# EAGLE design moonlamp (EAGLE 6.4)
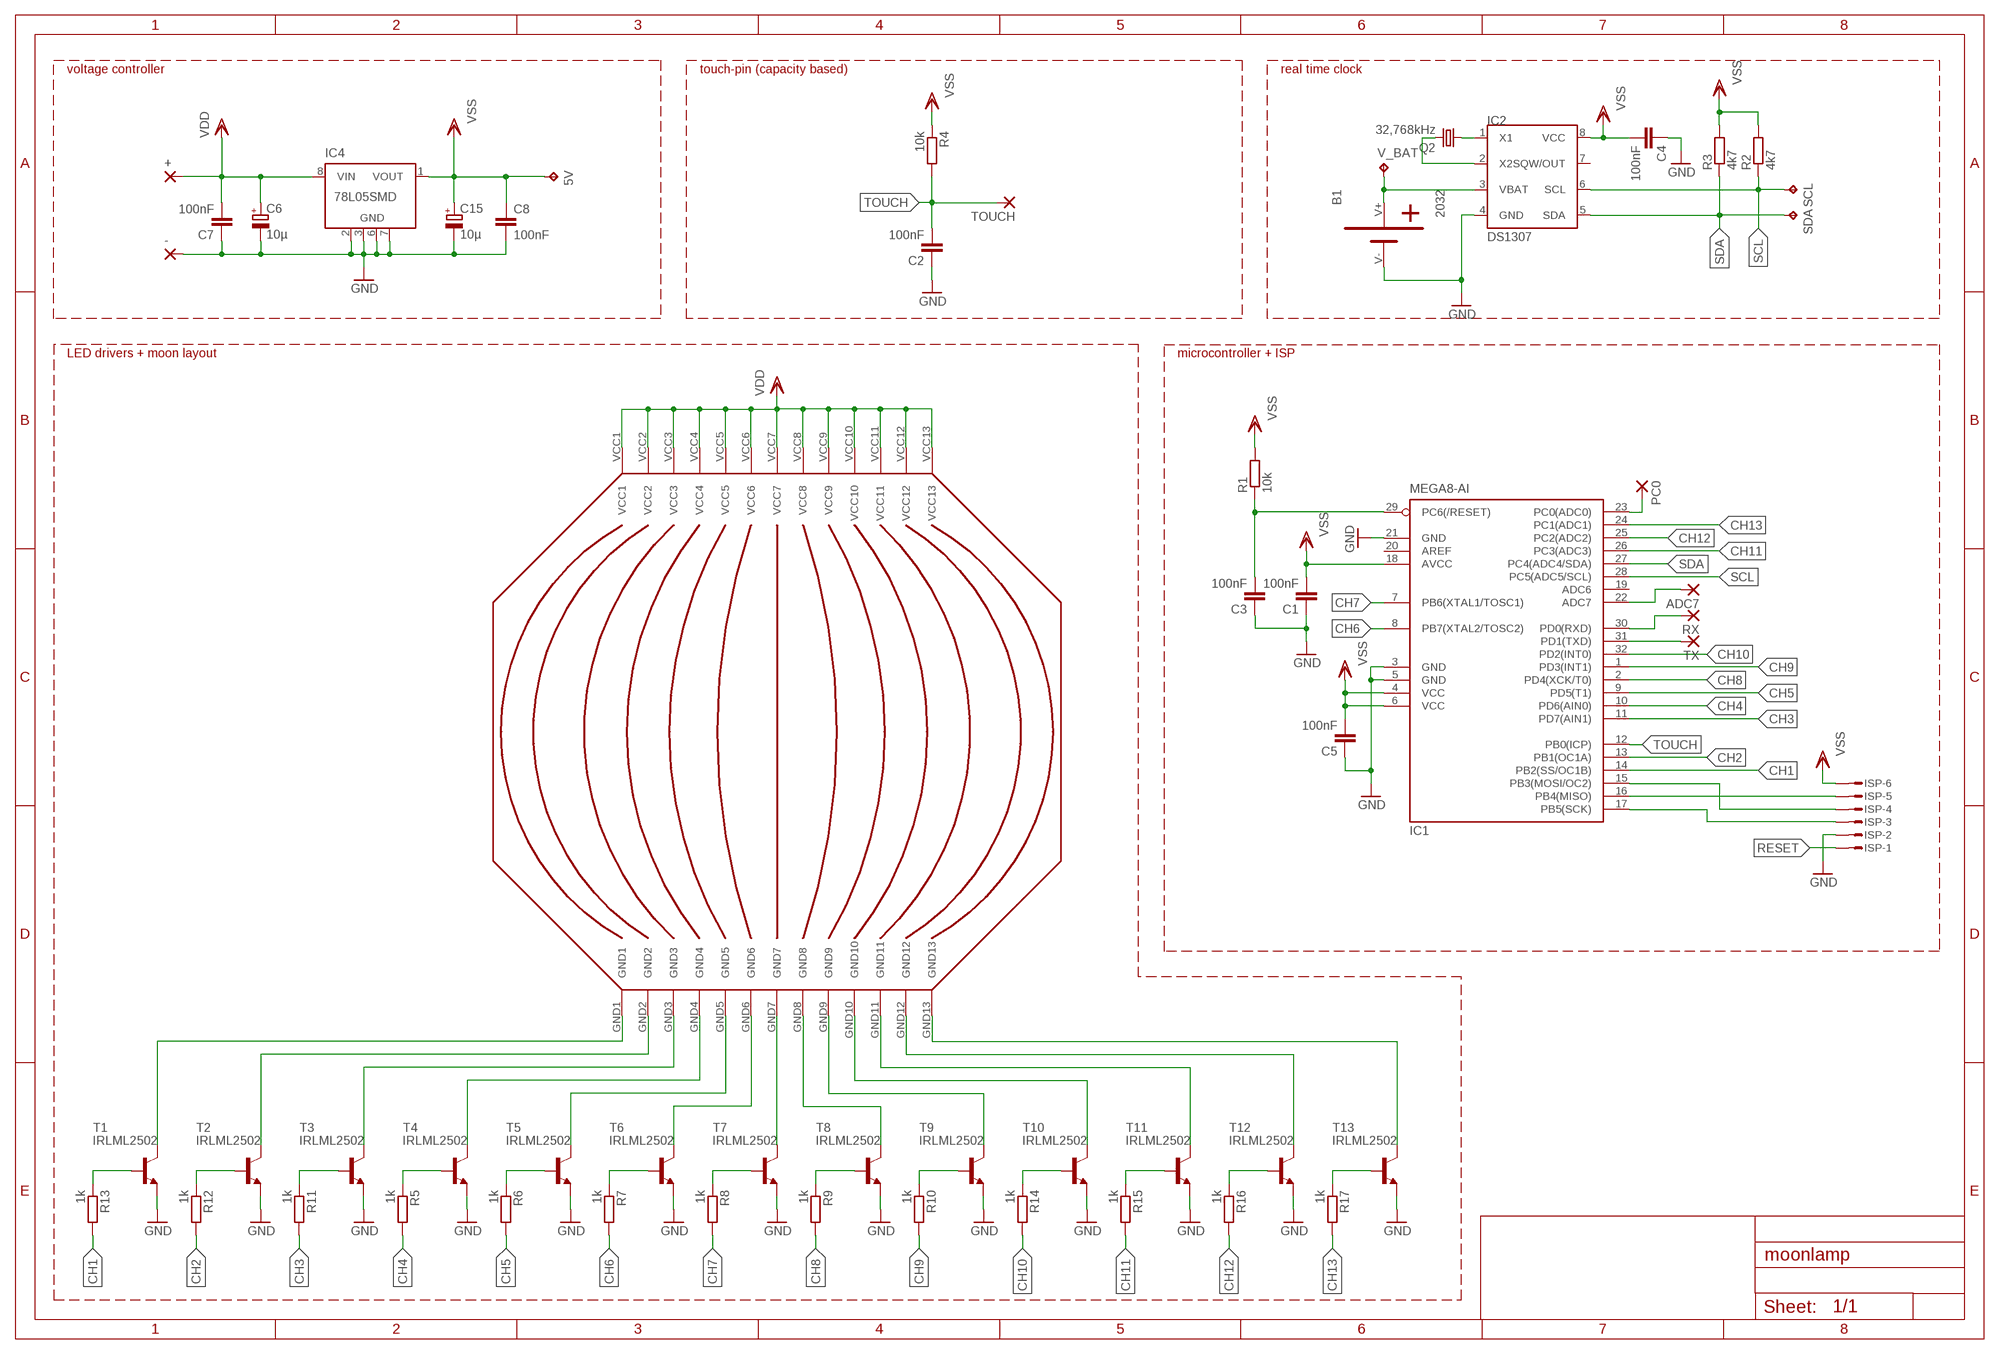
[diagram p0: schematic, sheet 1]

## Parts
5V  TPB1,27  [B1,27]
+  SMD5  [SMD2,54-5,08]
-  SMD5  [SMD2,54-5,08]
ADC7  SMD2  [SMD1,27-2,54]
B1  2032  [2032]
C1  100nF  C-EUC0603  [C0603]
C2  100nF  C-EUC0603  [C0603]
C3  100nF  C-EUC0603K  [C0603K]
C4  100nF  C-EUC0603  [C0603]
C5  100nF  C-EUC0603  [C0603]
C6  10µ  CPOL-EUSMCA  [SMC_A]
C7  100nF  C-EUC0603K  [C0603K]
C8  100nF  C-EUC0603K  [C0603K]
C15  10µ  CPOL-EUSMCA  [SMC_A]
IC1  MEGA8-AI  [TQFP32-08]
IC2  DS1307  [SOIC-8]
IC4  78L05SMD  [SO08]
ISP  MICROMATCH-6SMF  [MMT-F-SMD-6]
PC0  SMD2  [SMD1,27-2,54]
Q2  32,768kHz  CRYSTALMM20SS  [MM20SS]
R1  10k  R-EU_R0603  [R0603]
R2  4k7  R-EU_R0603  [R0603]
R3  4k7  R-EU_R0603  [R0603]
R4  10k  R-EU_R0603  [R0603]
R5  1k  R-EU_R1206  [R1206]
R6  1k  R-EU_R1206  [R1206]
R7  1k  R-EU_R1206  [R1206]
R8  1k  R-EU_R1206  [R1206]
R9  1k  R-EU_R1206  [R1206]
R10  1k  R-EU_R1206  [R1206]
R11  1k  R-EU_R1206  [R1206]
R12  1k  R-EU_R1206  [R1206]
R13  1k  R-EU_R1206  [R1206]
R14  1k  R-EU_R1206  [R1206]
R15  1k  R-EU_R1206  [R1206]
R16  1k  R-EU_R1206  [R1206]
R17  1k  R-EU_R1206  [R1206]
RX  SMD2  [SMD1,27-2,54]
SCL  TPB1,27  [B1,27]
SDA  TPB1,27  [B1,27]
T1  IRLML2502  BC847  [SOT23]
T2  IRLML2502  BC847  [SOT23]
T3  IRLML2502  BC847  [SOT23]
T4  IRLML2502  BC847  [SOT23]
T5  IRLML2502  BC847  [SOT23]
T6  IRLML2502  BC847  [SOT23]
T7  IRLML2502  BC847  [SOT23]
T8  IRLML2502  BC847  [SOT23]
T9  IRLML2502  BC847  [SOT23]
T10  IRLML2502  BC847  [SOT23]
T11  IRLML2502  BC847  [SOT23]
T12  IRLML2502  BC847  [SOT23]
T13  IRLML2502  BC847  [SOT23]
TOUCH  SMD2  [SMD1,27-2,54]
TX  SMD2  [SMD1,27-2,54]
U$1  MOON  [MOON]
V_BAT  TPB1,27  [B1,27]

## Nets
CH1: IC1.14(PB2(SS/OC1B)) R13.2
CH2: IC1.13(PB1(OC1A)) R12.2
CH3: IC1.11(PD7(AIN1)) R11.2
CH4: IC1.10(PD6(AIN0)) R5.2
CH5: IC1.9(PD5(T1)) R6.2
CH6: IC1.8(PB7(XTAL2/TOSC2)) R7.2
CH7: IC1.7(PB6(XTAL1/TOSC1)) R8.2
CH8: IC1.2(PD4(XCK/T0)) R9.2
CH9: IC1.1(PD3(INT1)) R10.2
CH10: IC1.32(PD2(INT0)) R14.2
CH11: IC1.26(PC3(ADC3)) R15.2
CH12: IC1.25(PC2(ADC2)) R16.2
CH13: IC1.24(PC1(ADC1)) R17.2
GND: -.1(P) B1.V- C1.1 C2.1 C3.1 C4.1 C5.1 C6.- C7.1 C8.2 C15.- IC1.3(GND) IC1.5(GND) IC1.21(GND) IC2.4(GND) IC4.2(GND) IC4.3(GND) IC4.6(GND) IC4.7(GND) ISP.2 T1.2(E) T2.2(E) T3.2(E) T4.2(E) T5.2(E) T6.2(E) T7.2(E) T8.2(E) T9.2(E) T10.2(E) T11.2(E) T12.2(E) T13.2(E)
N$2: ADC7.1(P) IC1.22(ADC7)
N$3: R5.1 T4.1(B)
N$4: IC1.31(PD1(TXD)) TX.1(P)
N$5: R6.1 T5.1(B)
N$6: R7.1 T6.1(B)
N$7: R8.1 T7.1(B)
N$8: R9.1 T8.1(B)
N$9: R10.1 T9.1(B)
N$10: B1.V+ IC2.3(VBAT) V_BAT.TP
N$11: R11.1 T3.1(B)
N$12: R12.1 T2.1(B)
N$13: IC2.1(X1) Q2.1
N$14: IC2.2(X2) Q2.4
N$16: R13.1 T1.1(B)
N$17: R14.1 T10.1(B)
N$18: R15.1 T11.1(B)
N$19: R16.1 T12.1(B)
N$20: R17.1 T13.1(B)
N$21: T7.3(C) U$1.GND7
N$22: IC1.30(PD0(RXD)) RX.1(P)
N$24: IC1.17(PB5(SCK)) ISP.3
N$25: IC1.16(PB4(MISO)) ISP.5
N$26: T1.3(C) U$1.GND1
N$27: T2.3(C) U$1.GND2
N$28: T3.3(C) U$1.GND3
N$29: T4.3(C) U$1.GND4
N$30: T5.3(C) U$1.GND5
N$31: T6.3(C) U$1.GND6
N$32: T8.3(C) U$1.GND8
N$33: T9.3(C) U$1.GND9
N$34: T10.3(C) U$1.GND10
N$35: T11.3(C) U$1.GND11
N$36: T12.3(C) U$1.GND12
N$37: T13.3(C) U$1.GND13
N$38: IC1.23(PC0(ADC0)) PC0.1(P)
N$40: IC1.15(PB3(MOSI/OC2)) ISP.4
RESET: C3.2 IC1.29(PC6(/RESET)) ISP.1 R1.1
SCL: IC1.28(PC5(ADC5/SCL)) IC2.6(SCL) R2.1 SCL.TP
SDA: IC1.27(PC4(ADC4/SDA)) IC2.5(SDA) R3.1 SDA.TP
TOUCH: C2.2 IC1.12(PB0(ICP)) R4.2 TOUCH.1(P)
VDD: +.1(P) C6.+ C7.2 IC4.8(VIN) U$1.VCC1 U$1.VCC2 U$1.VCC3 U$1.VCC4 U$1.VCC5 U$1.VCC6 U$1.VCC7 U$1.VCC8 U$1.VCC9 U$1.VCC10 U$1.VCC11 U$1.VCC12 U$1.VCC13
VSS: 5V.TP C1.2 C4.2 C5.2 C8.1 C15.+ IC1.4(VCC) IC1.6(VCC) IC1.18(AVCC) IC2.8(VCC) IC4.1(VOUT) ISP.6 R1.2 R2.2 R3.2 R4.1
Unconnected: IC1.19(ADC6) IC1.20(AREF) IC2.7(SQW/OUT) IC4.4(NC) IC4.5(NC)

## Notes on the sheet
- voltage controller | touch-pin (capacity based) | real time clock
- LED drivers + moon layout | microcontroller + ISP

## Library data of the parts
5V SCL SDA V_BAT = testpad:TP: Test pad
+ - = wirepad:SMD5: SMD PAD
ADC7 PC0 RX TOUCH TX = wirepad:SMD2: SMD PAD
B1 = 2032:2032: Reichelt: KZH 20SMD-2
C1-C5 C7 C8 = rcl:C-EU: CAPACITOR, European symbol
C6 C15 = rcl:CPOL-EU: POLARIZED CAPACITOR, European symbol
IC1 = atmel:MEGA8: MICROCONTROLLER 8 Kbytes FLASH, 1 kbytes SRAM, 512 bytes EEPROM, USART, 6-channel 10 bit ADC, 2-channel 8 bit ADC Pin compatible with Atmega48, ATMega88, ATMega168 Source: avr.lbr
IC2 = dallas-1:DS1307: I2C Serial RTC w/56 bytes battery backed RAM
IC4 = linear:78L*SMD: Positive VOLTAGE REGULATOR
ISP = con-amp-micromatch2:MICROMATCH-6: MicroMaTch 6 7-215464-6 / 0-215464-6 Drawing Number C-215464 DDEController.pdf
Q2 = crystal:CRYSTAL: CRYSTAL
R1-R17 = rcl:R-EU_: RESISTOR, European symbol
T1-T13 = transistor:BC847: NPN TRANSISTOR
U$1 = moon:MOON

## Board
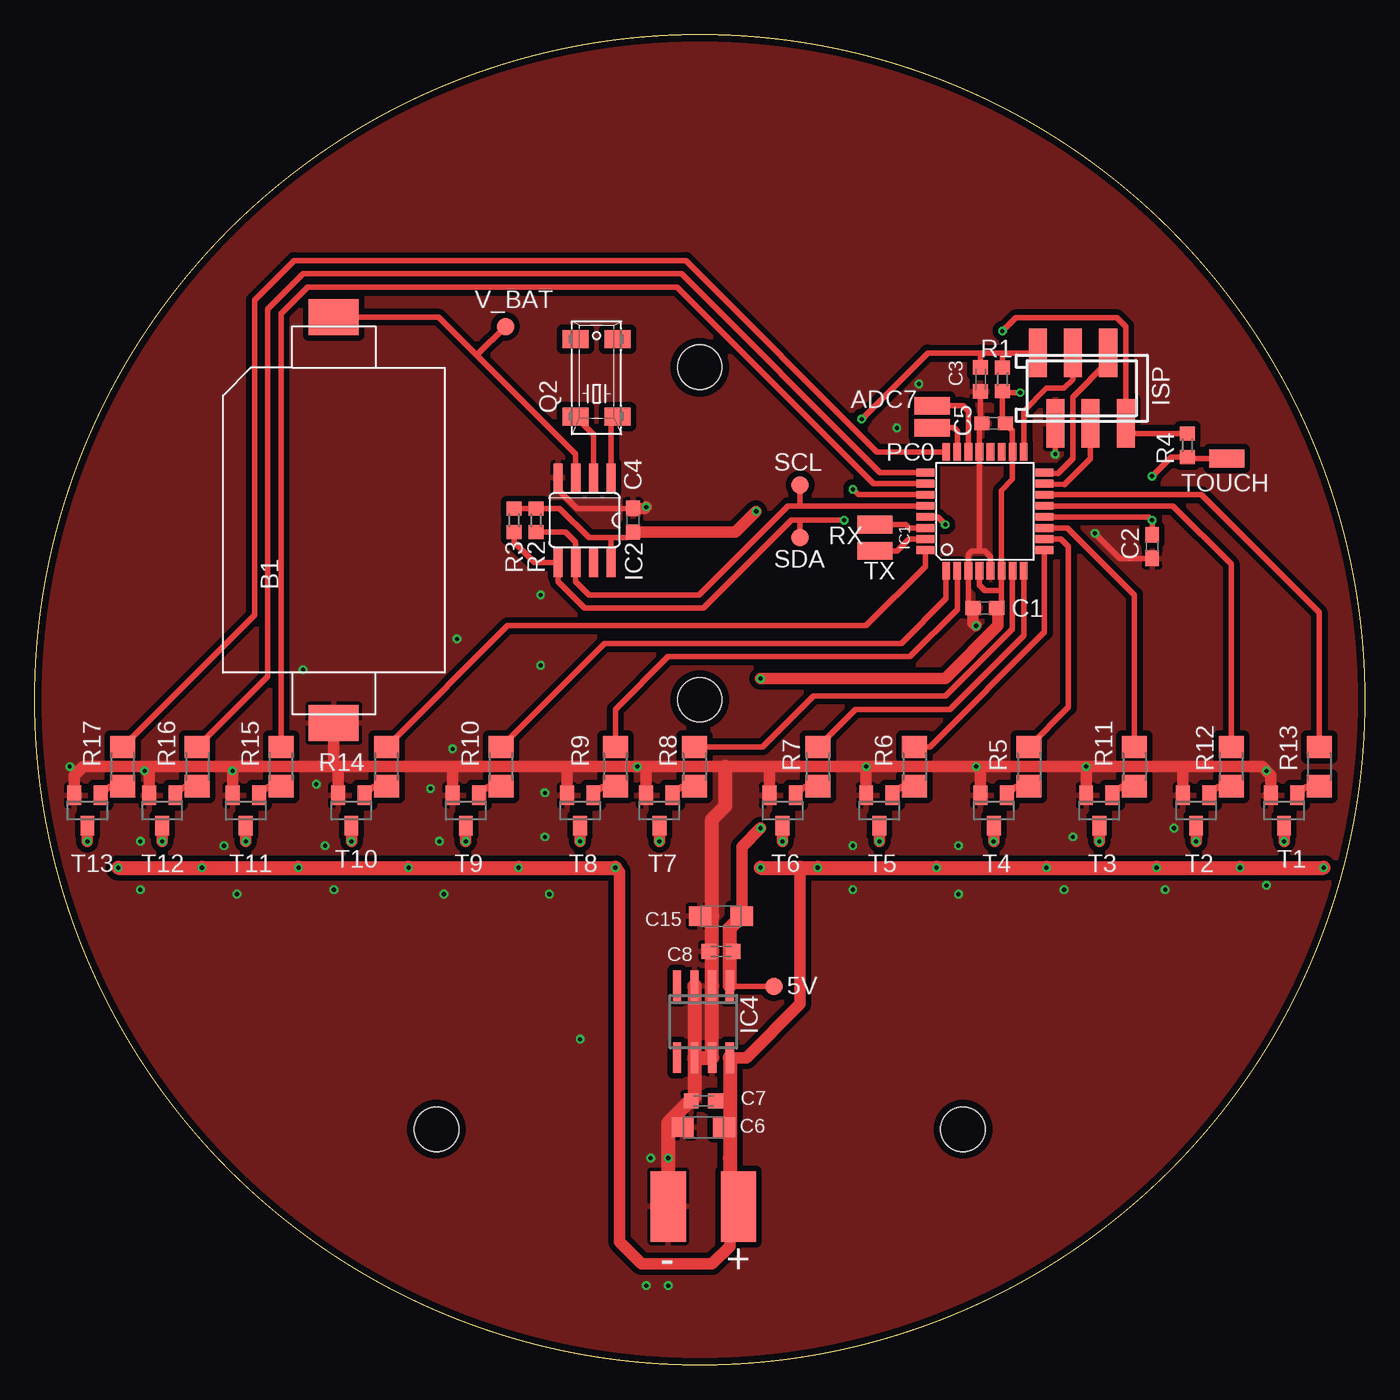
[diagram p1: board, top side]
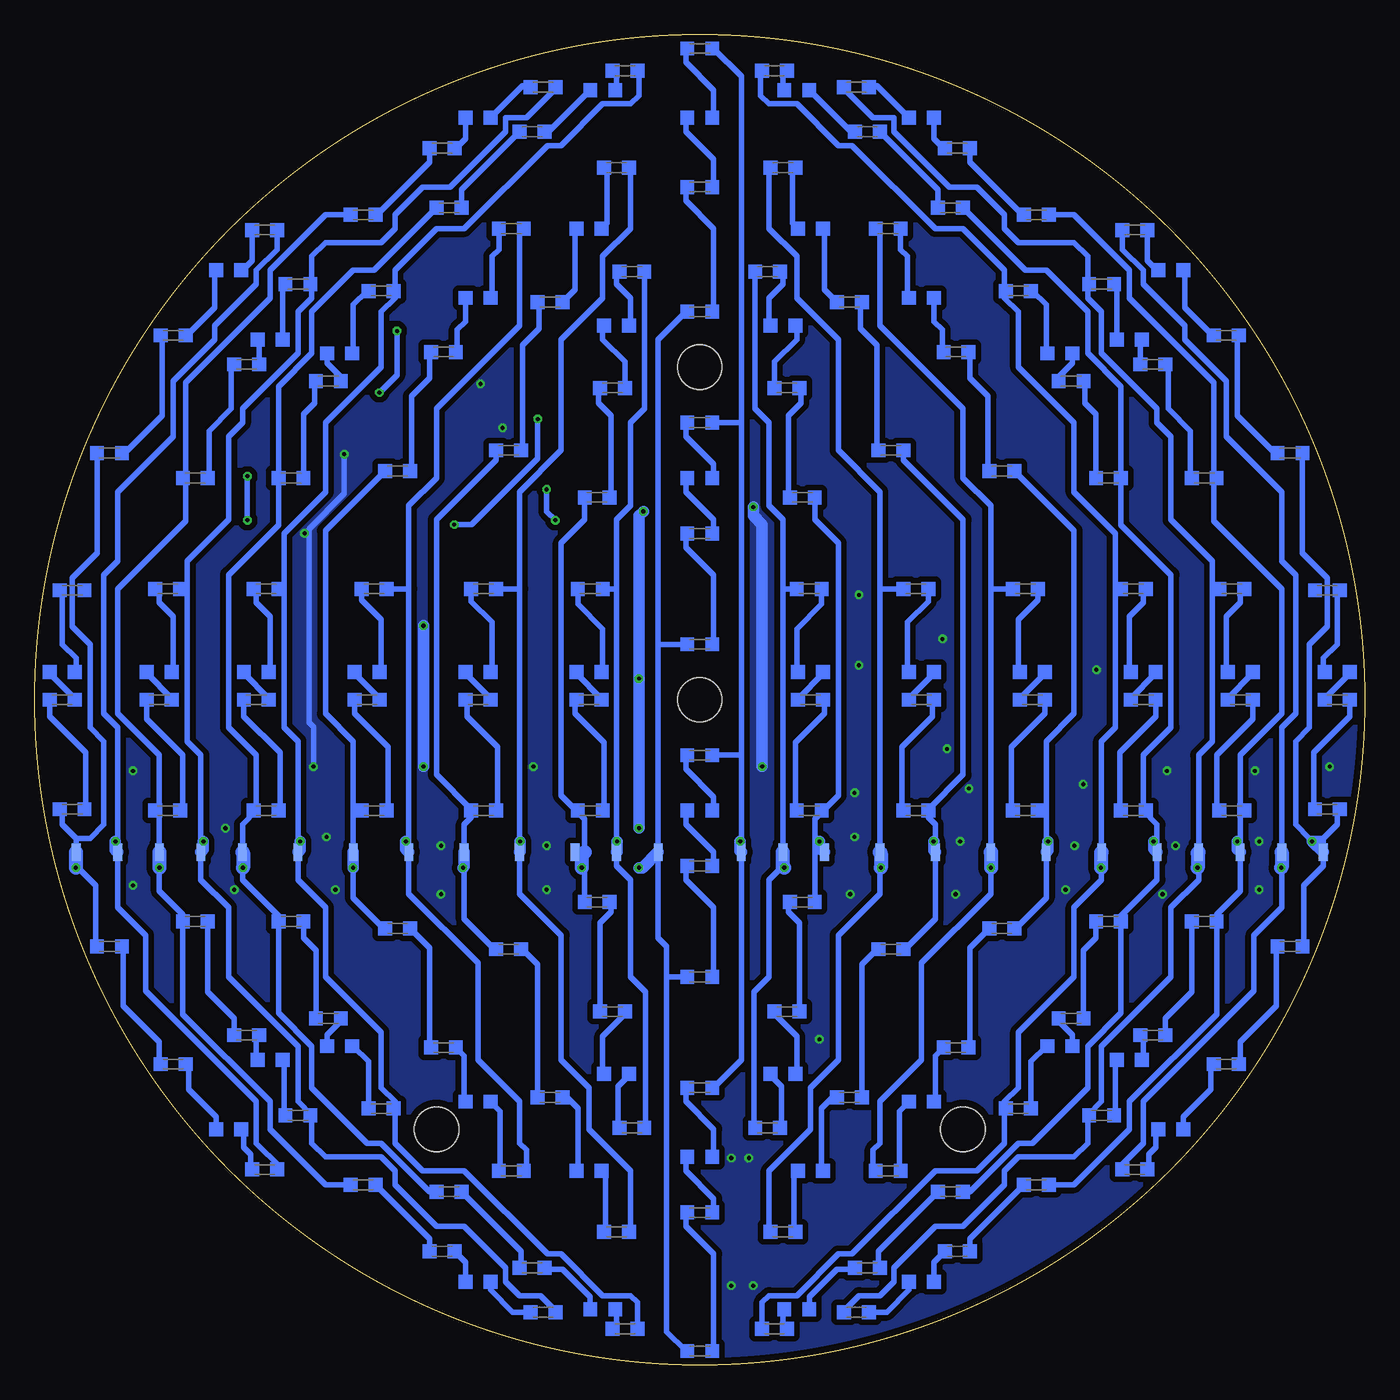
[diagram p2: board, bottom side, seen from below]

Size 96 x 96 mm. Coordinates in mm from the lower left corner, seen from the top.
Copper layers (1*16): Top 0.035mm / dielectric 1.6mm / Bottom 0.035mm
Design rules "Elecrow_2-layer_PCB_eagle_rule": minimum track width 6mil, minimum drill 12mil, track to track 6mil, track to pad 6mil, pad to pad 6mil, via to via 8mil, smd to smd 0mil, copper to edge 20mil, drill to drill 10mil, minimum pad ring 6mil, minimum via ring 6mil, stop-mask expansion 0mil, vias tented up to drill 100mil, thermal gap 10mil
Holes 3.2 mm at 48,48 29,17 67,17 48,72

### Footprints (pad centres in the part's own frame; a part is rotated, then mirrored left to right if it is on the bottom)
B1,27 = smd 1.27 x 1.27: TP 0,0
SMD2,54-5,08 = smd 2.54 x 5.08: 1 0,0
SMD1,27-2,54 = smd 1.27 x 2.54: 1 0,0
2032 = smd 2.6 x 3.6: V+ 14.65,0; V- -14.65,0
C0603 = smd 1.1 x 1: 1 -0.85,0; 2 0.85,0
C0603K = smd 1.05 x 1.08: 1 -0.875,0; 2 0.875,0
SMC_A = smd 1.6 x 1.4: + -1.5,0; - 1.5,0
TQFP32-08 = smd 1.27 x 0.559: 1 -4.293,2.8; 2 -4.293,2; 3 -4.293,1.2; 4 -4.293,0.4; 5 -4.293,-0.4; 6 -4.293,-1.2; 7 -4.293,-2; 8 -4.293,-2.8; 17 4.293,-2.8; 18 4.293,-2; 19 4.293,-1.2; 20 4.293,-0.4; 21 4.293,0.4; 22 4.293,1.2; 23 4.293,2; 24 4.293,2.8 | smd 0.559 x 1.27: 9 -2.8,-4.293; 10 -2,-4.293; 11 -1.2,-4.293; 12 -0.4,-4.293; 13 0.4,-4.293; 14 1.2,-4.293; 15 2,-4.293; 16 2.8,-4.293; 25 2.8,4.293; 26 2,4.293; 27 1.2,4.293; 28 0.4,4.293; 29 -0.4,4.293; 30 -1.2,4.293; 31 -2,4.293; 32 -2.8,4.293
SOIC-8 = smd 2.032 x 0.66: 1 -3.073,1.27; 2 -3.073,0; 3 -3.073,-1.27; 4 -3.073,-2.54; 5 3.073,-2.54; 6 3.073,-1.27; 7 3.073,0; 8 3.073,1.27
SO08 = smd 0.6 x 2.2: 1 -1.905,-2.6; 2 -0.635,-2.6; 3 0.635,-2.6; 4 1.905,-2.6; 5 1.905,2.6; 6 0.635,2.6; 7 -0.635,2.6; 8 -1.905,2.6
MMT-F-SMD-6 = smd 1.3 x 3.5: 1 3.175,-2.54; 2 1.905,2.54; 3 0.635,-2.54; 4 -0.635,2.54; 5 -1.905,-2.54; 6 -3.175,2.54
MM20SS = smd 1.27 x 1.88: 1 -2.794,-1.524; 2 2.794,-1.524; 3 2.794,1.524; 4 -2.794,1.524
R0603 = smd 1 x 1.1: 1 -0.85,0; 2 0.85,0
R1206 = smd 1.6 x 1.803: 1 -1.422,0; 2 1.422,0
SOT23 = smd 1 x 1.4: 1 -0.95,-1.1; 2 0.95,-1.1; 3 0,1.1
MOON = smd 0.635 x 1.27: GND1 -42,-11; GND2 -36,-11; GND3 -29,-11; GND4 -21,-11; GND5 -13,-11; GND6 -6,-11; GND7 3,-11; GND8 9,-11; GND9 17,-11; GND10 25,-11; GND11 33,-11; GND12 39,-11; GND13 45,-11; VCC1 -45,-11; VCC2 -39,-11; VCC3 -33,-11; VCC4 -25,-11; VCC5 -17,-11; VCC6 -9,-11; VCC7 -3,-11; VCC8 6,-11; VCC9 13,-11; VCC10 21,-11; VCC11 29,-11; VCC12 36,-11; VCC13 42,-11

### Placement (x,y rotation side)
5V  53.34,27.3 0 top
+  50.8,11.43 0 top
-  45.72,11.43 0 top
ADC7  64.77,69.22 90 top
B1  21.59,60.96 90 top
C1  68.58,54.61 0 top
C2  80.64,59.05 90 top
C3  68.26,71.12 90 top
C4  43.18,60.96 270 top
C5  69.22,67.94 0 top
C6  48.26,17.14 180 top
C7  48.26,19.05 0 top
C8  49.53,29.84 180 top
C15  49.53,32.38 180 top
IC1  68.58,61.59 90 top
IC2  40.32,60.96 270 top
IC4  48.26,24.77 180 top
ISP  75.56,70.48 180 top
PC0  64.77,67.63 90 top
Q2  40.55,71.23 90 top
R1  69.85,71.12 270 top
R2  36.2,60.96 90 top
R3  34.61,60.96 90 top
R4  83.19,66.36 270 top
R5  71.75,43.18 90 top
R6  63.5,43.18 90 top
R7  56.52,43.18 90 top
R8  47.62,43.18 90 top
R9  41.91,43.18 90 top
R10  33.66,43.18 90 top
R11  79.38,43.18 90 top
R12  86.36,43.18 90 top
R13  92.71,43.18 90 top
R14  25.4,43.18 90 top
R15  17.78,43.18 90 top
R16  11.75,43.18 90 top
R17  6.35,43.18 90 top
RX  60.64,60.64 270 top
SCL  55.24,63.5 0 top
SDA  55.24,59.69 0 top
T1  90.17,40.01 180 top
T2  83.82,40.01 180 top
T3  76.83,40.01 180 top
T4  69.22,40.01 180 top
T5  60.96,40.01 180 top
T6  53.98,40.01 180 top
T7  45.09,40.01 180 top
T8  39.37,40.01 180 top
T9  31.11,40.01 180 top
T10  22.86,40.01 180 top
T11  15.24,40.01 180 top
T12  9.21,40.01 180 top
T13  3.81,40.01 180 top
TOUCH  86.04,65.41 90 top
TX  60.64,58.74 270 top
U$1  48,48 0 bottom
V_BAT  33.97,74.93 0 top

### Tracks (layer width: path | path; a pad name or v marks a point on that pad's centre or on a via)
CH1
  Top 0.406: IC1.14 84.21,62.8 92.71,54.29 R13.2
CH2
  Top 0.406: IC1.13 82.15,61.99 86.36,57.78 R12.2
CH3
  Top 0.406: IC1.11 74.54,60.4 79.38,55.56 R11.2
CH4
  Top 0.406: IC1.10 74.07,59.59 74.61,59.05 74.61,47.46 R5.2
CH5
  Top 0.406: IC1.9 72.87,52.87 64.61,44.6 R6.2
CH6
  Top 0.406: IC1.8 71.38,52.65 66.04,47.31 59.22,47.31 R7.2
CH7
  Top 0.406: IC1.7 70.58,53.12 65.72,48.26 56.2,48.26 52.54,44.6 R8.2
CH8
  Top 0.406: R9.2 41.91,47.31 45.72,51.12 63.18,51.12 66.58,54.52 IC1.2
CH9
  Top 0.406: R10.2 41.12,52.07 62.55,52.07 65.78,55.3 IC1.1
CH10
  Top 0.406: R14.2 34.14,53.34 60.01,53.34 64.29,57.62 IC1.32
CH11
  Top 0.406: R15.2 17.78,75.88 19.68,77.79 46.35,77.79 60.55,63.59 IC1.26
CH12
  Top 0.406: R16.2 16.83,49.68 16.83,76.2 19.37,78.74 46.67,78.74 61.02,64.39 IC1.25
CH13
  Top 0.406: R17.2 15.88,54.13 15.88,76.83 18.73,79.69 46.99,79.69 60.8,65.89 IC1.24
GND  (via drill 0.3)
  Top 0.406: C1.1 67.38,54.96 IC1.3 67.38,58.49 67.63,58.74 68.26,58.74 | C3.1 68.26,68.05 C5.1 68.18,67.76 IC1.21 68.18,58.82 68.26,58.74 | IC2.4 37.78,63.18 39.16,61.81 C4.1 | 68.26,58.74 68.58,58.74 68.98,58.34 IC1.5 | ISP.2 v73.66,65.72 | v76.52,60.01 78.32,58.2 C2.1
  Top 0.813: T1.2 89.22,42.54 88.58,43.18 82.87,43.18 | 82.87,43.18 v75.88,43.18 | v75.88,43.18 68.26,43.18 | v60.01,43.18 v67.94,43.18 68.26,43.18 | v60.01,43.18 53.02,43.18 | 53.02,43.18 49.85,43.18 44.13,43.18 | 44.13,43.18 v43.5,43.18 | v43.5,43.18 38.42,43.18 | 38.42,43.18 30.16,43.18 | 30.16,43.18 21.91,43.18 | 21.91,43.18 21.59,43.18 | 21.59,43.18 14.29,43.18 | 14.29,43.18 8.26,43.18 | 8.26,43.18 3.49,43.18 2.86,42.55 T13.2 | T12.2 8.26,43.18 | T11.2 14.29,43.18 | T10.2 21.91,43.18 | B1.V- 21.59,43.18 | T9.2 30.16,43.18 | T8.2 38.42,43.18 | T7.2 44.13,43.18 | 44.13,43.18 | T6.2 53.02,43.18 | T5.2 v60.01,43.18 | T4.2 68.27,43.18 68.26,43.18 | T3.2 v75.89,43.18 v75.88,43.18 | T2.2 82.87,43.18 | 44.13,43.18 v43.5,43.18 | v44.13,61.91 44.03,61.81 C4.1 | v67.94,53.34 67.73,53.55 C1.1
  Top 1.016: IC4.6 47.62,19.37 47.38,19.13 | 47.38,19.13 45.72,17.46 45.72,17.14 | 45.72,17.14 -.1 | C6.- 45.72,17.14 | C7.1 47.38,19.13 | IC4.6 IC4.7 IC4.2 48.9,29.84 | IC4.3 IC4.6 | C8.2 48.9,29.84 | 48.9,29.84 48.9,32.38 | 48.9,32.38 48.9,39.37 49.85,40.32 49.85,43.18 | C15.- 48.9,32.38
  Bottom 0.406: v73.66,65.72 73.66,62.87 76.2,60.33 76.2,60.01 | 76.2,60.01 76.2,46.35 75.88,46.04 v75.88,43.18 | 76.2,60.01 v76.52,60.01
  Bottom 0.813: v43.5,43.18 43.5,60.64 44.13,61.28 v44.13,61.91 | v67.94,43.18 v67.94,53.34
  other vias: 44.45,14.92 45.72,14.92 45.72,5.71 44.13,5.71 39.37,23.5 37.15,33.97 36.83,38.1 36.83,41.27 36.51,50.48 36.51,55.56 30.16,44.45 30.48,52.39 19.37,50.16 20.32,41.91 14.29,42.86 7.94,42.86 2.54,43.18 7.62,37.78 7.62,34.29 14.61,33.97 13.65,37.47 20.95,37.47 21.59,34.29 29.53,33.97 29.21,37.78 28.57,41.59 59.05,34.29 59.05,37.47 66.67,37.47 66.67,33.97 74.3,34.29 74.93,38.1 82.23,38.73 81.6,34.29 88.9,34.61 88.9,42.86 62.23,67.63 63.82,70.8
  pour Bottom (isolate 0.406): -4.13,101.28 104.46,101.28 104.46,-5.4 -4.13,-5.4
  pour Top (isolate 0.406): -6.35,102.87 101.28,102.87 101.28,-2.22 -6.35,-2.22 -6.35,102.55
N$2
  Top 0.406: IC1.22 67.38,68.83 66.99,69.22 ADC7.1
N$3
  Top 0.406: R5.1 70.82,41.76 T4.1
N$4
  Top 0.406: IC1.31 63.09,59.59 62.23,58.74 TX.1
N$5
  Top 0.406: R6.1 62.56,41.76 T5.1
N$6
  Top 0.406: R7.1 55.58,41.76 T6.1
N$7
  Top 0.406: R8.1 46.69,41.76 T7.1
N$8
  Top 0.406: R9.1 40.97,41.76 T8.1
N$9
  Top 0.406: R10.1 32.72,41.76 T9.1
N$10
  Top 0.406: IC2.3 39.05,65.72 31.91,72.87 | 31.91,72.87 29.16,75.61 B1.V+ | V_BAT.TP 31.91,72.87
N$11
  Top 0.406: R11.1 78.44,41.76 T3.1
N$12
  Top 0.406: R12.1 85.42,41.76 T2.1
N$13
  Top 0.406: IC2.1 41.59,67.95 Q2.1
N$14
  Top 0.406: IC2.2 40.32,67.14 Q2.4
N$16
  Top 0.406: R13.1 91.77,41.76 T1.1
N$17
  Top 0.406: R14.1 24.46,41.76 T10.1
N$18
  Top 0.406: R15.1 16.84,41.76 T11.1
N$19
  Top 0.406: R16.1 10.81,41.76 T12.1
N$20
  Top 0.406: T13.1 5.41,41.76 R17.1
N$21  (via drill 0.3)
  Top 0.813: T7.3 v45.09,37.78
  Bottom 0.813: v45.09,37.78 45.09,37.09 U$1.GND7
N$22
  Top 0.406: IC1.30 63.11,60.4 62.87,60.64 RX.1
N$24
  Top 0.406: ISP.3 74.93,71.12 74.3,70.48 73.03,70.48 71.38,68.84 IC1.17
N$25
  Top 0.406: IC1.16 73.84,64.31 74.93,65.41 74.93,69.85 77.47,72.39 ISP.5
N$26  (via drill 0.3)
  Top 0.813: T1.3 v90.17,37.78
  Bottom 0.813: v90.17,37.78 90.17,37.17 U$1.GND1
N$27  (via drill 0.3)
  Top 0.813: T2.3 v83.82,37.78
  Bottom 0.813: v83.82,37.78 83.82,37.18 U$1.GND2
N$28  (via drill 0.3)
  Top 0.813: T3.3 v76.83,37.78
  Bottom 0.813: v76.83,37.78 76.83,37.16 U$1.GND3
N$29  (via drill 0.3)
  Top 0.813: T4.3 v69.22,37.78
  Bottom 0.813: v69.22,37.78 69.22,37.22 U$1.GND4
N$30  (via drill 0.3)
  Top 0.813: T5.3 v60.96,37.78
  Bottom 0.813: v60.96,37.78 60.96,37.04 U$1.GND5
N$31  (via drill 0.3)
  Top 0.813: T6.3 v53.98,37.78
  Bottom 0.813: v53.98,37.78 53.98,37.02 U$1.GND6
N$32  (via drill 0.3)
  Top 0.813: T8.3 v39.37,37.78
  Bottom 0.813: v39.37,37.78 39.37,37.37 U$1.GND8
N$33  (via drill 0.3)
  Top 0.813: T9.3 v31.11,37.78
  Bottom 0.813: v31.11,37.78 31.11,37.12 U$1.GND9
N$34  (via drill 0.3)
  Top 0.813: T10.3 v22.86,37.78
  Bottom 0.813: v22.86,37.78 22.86,37.14 U$1.GND10
N$35  (via drill 0.3)
  Top 0.813: T11.3 v15.24,37.78
  Bottom 0.813: v15.24,37.78 15.24,37.24 U$1.GND11
N$36  (via drill 0.3)
  Top 0.813: T12.3 v9.21,37.78
  Bottom 0.813: v9.21,37.78 9.21,37.21 U$1.GND12
N$37  (via drill 0.3)
  Top 0.813: T13.3 v3.81,37.78
  Bottom 0.813: v3.81,37.78 3.78,37.78 U$1.GND13
N$38
  Top 0.406: IC1.23 66.58,67.41 66.36,67.63 PC0.1
N$40
  Top 0.406: IC1.15 74.31,63.52 76.2,65.41 ISP.4
RESET  (via drill 0.3)
  Top 0.406: IC1.29 65.17,61.2 v65.72,60.64 | v59.69,68.26 64.45,73.03 68.26,73.03 | 68.26,73.03 69.85,73.03 | R1.1 69.85,73.03 | C3.2 68.26,73.03 | 69.85,73.03 ISP.1
  Bottom 0.406: v65.72,60.64 64.45,60.64 59.69,65.41 v59.69,68.26
SCL
  Top 0.406: R2.1 38.31,60.11 39.05,59.37 IC2.6 39.05,56.52 40.01,55.56 47.94,55.56 54.38,61.99 55.24,61.99 | SCL.TP 55.24,61.99 | 55.24,61.99 IC1.28
SDA  (via drill 0.3)
  Top 0.406: R3.1 34.61,59.37 36.09,57.89 IC2.5 37.78,56.52 39.69,54.61 48.26,54.61 54.61,60.96 55.24,60.96 | v59.05,63.18 59.44,62.8 IC1.27 | v58.42,60.96 55.24,60.96 | SDA.TP 55.24,60.96
  Bottom 0.406: v59.05,63.18 59.05,61.59 v58.42,60.96
TOUCH  (via drill 0.3)
  Top 0.406: C2.2 v80.64,60.96 80.41,61.2 IC1.12 | TOUCH.1 83.29,65.41 R4.2 82.02,65.51 v80.64,64.14
  Bottom 0.406: v80.64,64.14 v80.64,60.96
VDD  (via drill 0.3)
  Top 0.813: IC4.8 51.38,22.16 55.24,26.04 55.24,35.88 | 50.16,14.92 50.16,8.57 48.9,7.3 43.81,7.3 42.23,8.89 42.23,35.56 v41.91,35.88
  Top 1.016: IC4.8 50.16,19.05 | 50.16,19.05 50.16,16.83 | 50.16,16.83 50.16,14.92 50.16,12.06 +.1 | C7.2 50.16,19.05 | C6.+ 49.85,17.14 50.16,16.83 | v6.03,35.88 v12.06,35.88 v19.05,35.88 v26.99,35.88 v34.92,35.88 v41.91,35.88 | v52.39,35.88 55.24,35.88 v56.52,35.88 v65.09,35.88 v73.03,35.88 v80.96,35.88 v87,35.88 v93.03,35.88
  Bottom 0.813: U$1.VCC4 73,35.9 v73.03,35.88 | U$1.VCC5 65,35.97 v65.09,35.88 | U$1.VCC7 52.12,35.88 v52.39,35.88
  Bottom 1.016: U$1.VCC13 6,35.91 v6.03,35.88 | v41.91,35.88 42,35.97 U$1.VCC8 | U$1.VCC9 34.92,36.92 v34.92,35.88 | U$1.VCC10 26.99,36.99 v26.99,35.88 | U$1.VCC11 19.05,36.95 v19.05,35.88 | U$1.VCC12 12.06,36.94 v12.06,35.88 | v93.03,35.88 93,35.91 U$1.VCC1 | U$1.VCC2 v87,35.88 | U$1.VCC3 80.96,36.96 v80.96,35.88 | 56.3,37 56.52,36.78 v56.52,35.88
VSS  (via drill 0.3)
  Top 0.406: 69.78,55.88 IC1.6 69.78,63.11 70.58,63.91 IC1.18 70.58,67.43 C5.2 69.85,68.16 R1.2 69.95,70.17 v71.12,70.17 | 69.78,55.88 69.78,54.96 C1.2 | IC1.4 68.18,56.28 68.58,55.88 69.78,55.88 | R3.2 R2.2 37.88,61.81 40.01,59.69 41.59,59.69 | 41.59,59.69 42.76,59.69 C4.2 | IC2.8 41.59,59.69 | 5V.TP 50.23,27.3 IC4.1 | R4.1 78.84,67.21 78.74,67.31 ISP.6 78.74,74.93 78.11,75.56 70.8,75.56 v69.85,74.61
  Top 0.813: C15.+ 51.03,37.38 v52.39,38.73 | v52.07,61.59 50.59,60.11 C4.2 | v52.39,49.53 65.72,49.53 69.53,53.34 69.53,54.51 C1.2
  Top 1.016: IC4.1 50.16,29.84 | 50.16,29.84 50.16,31.52 C15.+ | C8.1 50.16,29.84
  Bottom 0.406: v69.85,74.61 69.85,71.44 v71.12,70.17
  Bottom 0.813: v52.39,38.73 v52.39,49.53 52.39,61.28 v52.07,61.59